# EAGLE schematic Yet-Another-LED-Cube (EAGLE 6.1)
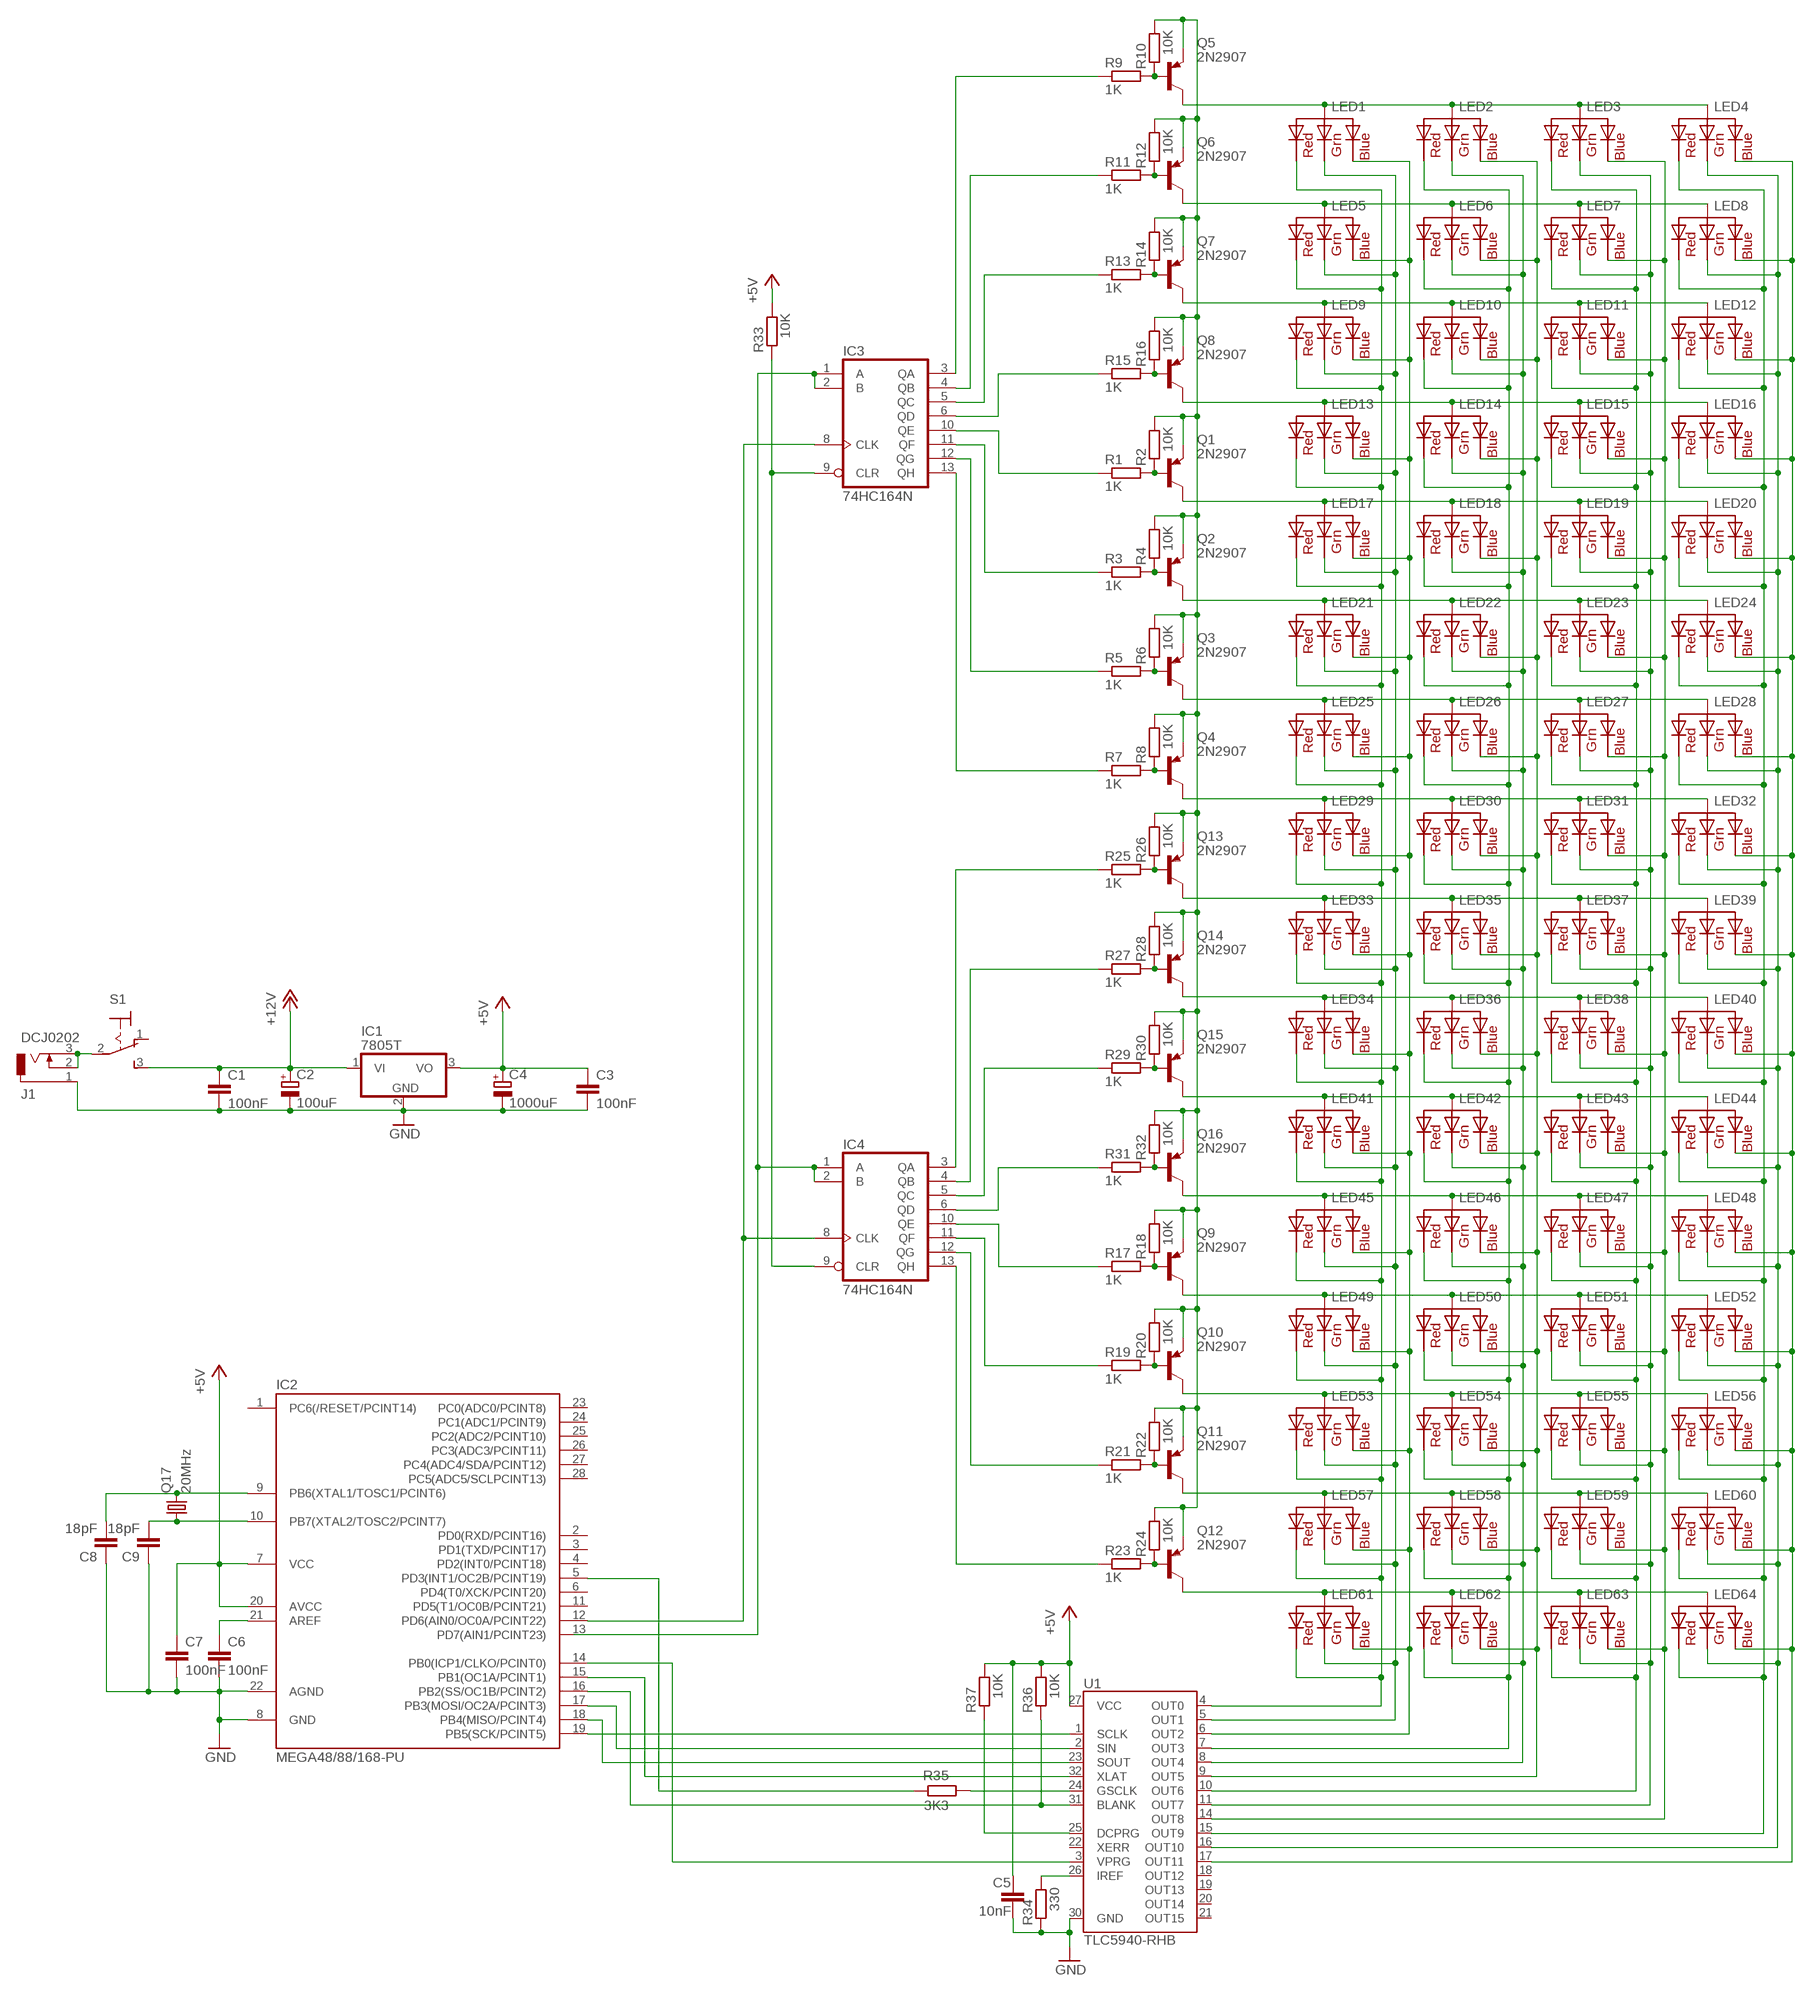
[diagram p0: schematic, sheet 1]

## Parts
C1  100nF  C-EU025-024X044  [C025-024X044]
C2  100uF  CPOL-EUE2.5-7  [E2,5-7]
C3  100nF  C-EU025-024X044  [C025-024X044]
C4  1000uF  CPOL-EUE3.5-10  [E3,5-10]
C5  10nF  C-EU025-024X044  [C025-024X044]
C6  100nF  C-EU025-024X044  [C025-024X044]
C7  100nF  C-EU025-024X044  [C025-024X044]
C8  18pF  C-EU025-024X044  [C025-024X044]
C9  18pF  C-EU025-024X044  [C025-024X044]
IC1  7805T  [TO220H]
IC2  MEGA48/88/168-PU  [DIL28-3]
IC3  74HC164N  [DIL14]
IC4  74HC164N  [DIL14]
J1  DCJ0202  [DCJ0202]
LED1  RGBLED_CAA  [LED5MMRGB2]
LED2  RGBLED_CAA  [LED5MMRGB2]
LED3  RGBLED_CAA  [LED5MMRGB2]
LED4  RGBLED_CAA  [LED5MMRGB2]
LED5  RGBLED_CAA  [LED5MMRGB2]
LED6  RGBLED_CAA  [LED5MMRGB2]
LED7  RGBLED_CAA  [LED5MMRGB2]
LED8  RGBLED_CAA  [LED5MMRGB2]
LED9  RGBLED_CAA  [LED5MMRGB2]
LED10  RGBLED_CAA  [LED5MMRGB2]
LED11  RGBLED_CAA  [LED5MMRGB2]
LED12  RGBLED_CAA  [LED5MMRGB2]
LED13  RGBLED_CAA  [LED5MMRGB2]
LED14  RGBLED_CAA  [LED5MMRGB2]
LED15  RGBLED_CAA  [LED5MMRGB2]
LED16  RGBLED_CAA  [LED5MMRGB2]
LED17  RGBLED_CAA  [LED5MMRGB2]
LED18  RGBLED_CAA  [LED5MMRGB2]
LED19  RGBLED_CAA  [LED5MMRGB2]
LED20  RGBLED_CAA  [LED5MMRGB2]
LED21  RGBLED_CAA  [LED5MMRGB2]
LED22  RGBLED_CAA  [LED5MMRGB2]
LED23  RGBLED_CAA  [LED5MMRGB2]
LED24  RGBLED_CAA  [LED5MMRGB2]
LED25  RGBLED_CAA  [LED5MMRGB2]
LED26  RGBLED_CAA  [LED5MMRGB2]
LED27  RGBLED_CAA  [LED5MMRGB2]
LED28  RGBLED_CAA  [LED5MMRGB2]
LED29  RGBLED_CAA  [LED5MMRGB2]
LED30  RGBLED_CAA  [LED5MMRGB2]
LED31  RGBLED_CAA  [LED5MMRGB2]
LED32  RGBLED_CAA  [LED5MMRGB2]
LED33  RGBLED_CAA  [LED5MMRGB2]
LED34  RGBLED_CAA  [LED5MMRGB2]
LED35  RGBLED_CAA  [LED5MMRGB2]
LED36  RGBLED_CAA  [LED5MMRGB2]
LED37  RGBLED_CAA  [LED5MMRGB2]
LED38  RGBLED_CAA  [LED5MMRGB2]
LED39  RGBLED_CAA  [LED5MMRGB2]
LED40  RGBLED_CAA  [LED5MMRGB2]
LED41  RGBLED_CAA  [LED5MMRGB2]
LED42  RGBLED_CAA  [LED5MMRGB2]
LED43  RGBLED_CAA  [LED5MMRGB2]
LED44  RGBLED_CAA  [LED5MMRGB2]
LED45  RGBLED_CAA  [LED5MMRGB2]
LED46  RGBLED_CAA  [LED5MMRGB2]
LED47  RGBLED_CAA  [LED5MMRGB2]
LED48  RGBLED_CAA  [LED5MMRGB2]
LED49  RGBLED_CAA  [LED5MMRGB2]
LED50  RGBLED_CAA  [LED5MMRGB2]
LED51  RGBLED_CAA  [LED5MMRGB2]
LED52  RGBLED_CAA  [LED5MMRGB2]
LED53  RGBLED_CAA  [LED5MMRGB2]
LED54  RGBLED_CAA  [LED5MMRGB2]
LED55  RGBLED_CAA  [LED5MMRGB2]
LED56  RGBLED_CAA  [LED5MMRGB2]
LED57  RGBLED_CAA  [LED5MMRGB2]
LED58  RGBLED_CAA  [LED5MMRGB2]
LED59  RGBLED_CAA  [LED5MMRGB2]
LED60  RGBLED_CAA  [LED5MMRGB2]
LED61  RGBLED_CAA  [LED5MMRGB2]
LED62  RGBLED_CAA  [LED5MMRGB2]
LED63  RGBLED_CAA  [LED5MMRGB2]
LED64  RGBLED_CAA  [LED5MMRGB2]
Q1  2N2907  [TO18]
Q2  2N2907  [TO18]
Q3  2N2907  [TO18]
Q4  2N2907  [TO18]
Q5  2N2907  [TO18]
Q6  2N2907  [TO18]
Q7  2N2907  [TO18]
Q8  2N2907  [TO18]
Q9  2N2907  [TO18]
Q10  2N2907  [TO18]
Q11  2N2907  [TO18]
Q12  2N2907  [TO18]
Q13  2N2907  [TO18]
Q14  2N2907  [TO18]
Q15  2N2907  [TO18]
Q16  2N2907  [TO18]
Q17  20MHz  CRYSTALHC49S  [HC49/S]
R1  1K  R-EU_0204/2V  [0204V]
R2  10K  R-EU_0204/2V  [0204V]
R3  1K  R-EU_0204/2V  [0204V]
R4  10K  R-EU_0204/2V  [0204V]
R5  1K  R-EU_0204/2V  [0204V]
R6  10K  R-EU_0204/2V  [0204V]
R7  1K  R-EU_0204/2V  [0204V]
R8  10K  R-EU_0204/2V  [0204V]
R9  1K  R-EU_0204/2V  [0204V]
R10  10K  R-EU_0204/2V  [0204V]
R11  1K  R-EU_0204/2V  [0204V]
R12  10K  R-EU_0204/2V  [0204V]
R13  1K  R-EU_0204/2V  [0204V]
R14  10K  R-EU_0204/2V  [0204V]
R15  1K  R-EU_0204/2V  [0204V]
R16  10K  R-EU_0204/2V  [0204V]
R17  1K  R-EU_0204/2V  [0204V]
R18  10K  R-EU_0204/2V  [0204V]
R19  1K  R-EU_0204/2V  [0204V]
R20  10K  R-EU_0204/2V  [0204V]
R21  1K  R-EU_0204/2V  [0204V]
R22  10K  R-EU_0204/2V  [0204V]
R23  1K  R-EU_0204/2V  [0204V]
R24  10K  R-EU_0204/2V  [0204V]
R25  1K  R-EU_0204/2V  [0204V]
R26  10K  R-EU_0204/2V  [0204V]
R27  1K  R-EU_0204/2V  [0204V]
R28  10K  R-EU_0204/2V  [0204V]
R29  1K  R-EU_0204/2V  [0204V]
R30  10K  R-EU_0204/2V  [0204V]
R31  1K  R-EU_0204/2V  [0204V]
R32  10K  R-EU_0204/2V  [0204V]
R33  10K  R-EU_0204/2V  [0204V]
R34  330  R-EU_0204/2V  [0204V]
R35  3K3  R-EU_0204/2V  [0204V]
R36  10K  R-EU_0204/2V  [0204V]
R37  10K  R-EU_0204/2V  [0204V]
S1  320-916  [320-916]
U1  TLC5940-RHB  [QFN-32]

## Nets
+5V: C3.1 C4.+ C5.1 C7.1 IC1.3(VO) IC2.7(VCC) IC2.20(AVCC) R33.2 R36.2 R37.2 U1.27(VCC)
+12V: C1.1 C2.+ IC1.1(VI) S1.3(S)
GND: C1.2 C2.- C3.2 C4.- C5.2 C6.2 C7.2 C8.1 C9.1 IC1.2(GND) IC2.8(GND) IC2.22(AGND) J1.1 R34.1 U1.30(GND)
N$1: J1.2 J1.3 S1.2(P)
N$2: Q1.2(B) R1.2 R2.1
N$3: Q2.2(B) R3.2 R4.1
N$4: Q3.2(B) R5.2 R6.1
N$5: Q4.2(B) R7.2 R8.1
N$6: Q5.2(B) R9.2 R10.1
N$7: Q6.2(B) R11.2 R12.1
N$8: Q7.2(B) R13.2 R14.1
N$9: Q8.2(B) R15.2 R16.1
N$10: LED1.P$1(RED) LED5.P$1(RED) LED9.P$1(RED) LED13.P$1(RED) LED17.P$1(RED) LED21.P$1(RED) LED25.P$1(RED) LED29.P$1(RED) LED33.P$1(RED) LED34.P$1(RED) LED41.P$1(RED) LED45.P$1(RED) LED49.P$1(RED) LED53.P$1(RED) LED57.P$1(RED) LED61.P$1(RED) U1.4(OUT0)
N$11: IC3.12(QG) R5.1
N$12: IC3.11(QF) R3.1
N$13: IC3.10(QE) R1.1
N$14: IC3.3(QA) R9.1
N$15: IC3.4(QB) R11.1
N$16: IC3.5(QC) R13.1
N$17: IC3.6(QD) R15.1
N$18: LED1.P$3(GREEN) LED5.P$3(GREEN) LED9.P$3(GREEN) LED13.P$3(GREEN) LED17.P$3(GREEN) LED21.P$3(GREEN) LED25.P$3(GREEN) LED29.P$3(GREEN) LED33.P$3(GREEN) LED34.P$3(GREEN) LED41.P$3(GREEN) LED45.P$3(GREEN) LED49.P$3(GREEN) LED53.P$3(GREEN) LED57.P$3(GREEN) LED61.P$3(GREEN) U1.5(OUT1)
N$19: Q9.2(B) R17.2 R18.1
N$20: Q10.2(B) R19.2 R20.1
N$21: Q11.2(B) R21.2 R22.1
N$22: Q12.2(B) R23.2 R24.1
N$23: Q13.2(B) R25.2 R26.1
N$24: Q14.2(B) R27.2 R28.1
N$25: Q15.2(B) R29.2 R30.1
N$26: Q16.2(B) R31.2 R32.1
N$27: IC4.12(QG) R21.1
N$28: IC4.11(QF) R19.1
N$29: IC4.10(QE) R17.1
N$30: IC4.3(QA) R25.1
N$31: IC4.4(QB) R27.1
N$32: IC4.5(QC) R29.1
N$33: IC4.6(QD) R31.1
N$34: IC2.19(PB5(SCK/PCINT5)) U1.1(SCLK)
N$35: LED1.P$2(VCC) LED2.P$2(VCC) LED3.P$2(VCC) LED4.P$2(VCC) Q5.3(C)
N$36: IC2.12(PD6(AIN0/OC0A/PCINT22)) IC3.8(CLK) IC4.8(CLK)
N$37: IC3.1(A) IC3.2(B) IC4.1(A) IC4.2(B)
N$38: LED1.P$4(BLUE) LED5.P$4(BLUE) LED9.P$4(BLUE) LED13.P$4(BLUE) LED17.P$4(BLUE) LED21.P$4(BLUE) LED25.P$4(BLUE) LED29.P$4(BLUE) LED33.P$4(BLUE) LED34.P$4(BLUE) LED41.P$4(BLUE) LED45.P$4(BLUE) LED49.P$4(BLUE) LED53.P$4(BLUE) LED57.P$4(BLUE) LED61.P$4(BLUE) U1.6(OUT2)
N$39: IC2.17(PB3(MOSI/OC2A/PCINT3)) U1.2(SIN)
N$40: IC3.9(CLR) IC4.9(CLR) R33.1
N$41: LED5.P$2(VCC) LED6.P$2(VCC) LED7.P$2(VCC) LED8.P$2(VCC) Q6.3(C)
N$42: LED2.P$1(RED) LED6.P$1(RED) LED10.P$1(RED) LED14.P$1(RED) LED18.P$1(RED) LED22.P$1(RED) LED26.P$1(RED) LED30.P$1(RED) LED35.P$1(RED) LED36.P$1(RED) LED42.P$1(RED) LED46.P$1(RED) LED50.P$1(RED) LED54.P$1(RED) LED58.P$1(RED) LED62.P$1(RED) U1.7(OUT3)
N$43: LED2.P$3(GREEN) LED6.P$3(GREEN) LED10.P$3(GREEN) LED14.P$3(GREEN) LED18.P$3(GREEN) LED22.P$3(GREEN) LED26.P$3(GREEN) LED30.P$3(GREEN) LED35.P$3(GREEN) LED36.P$3(GREEN) LED42.P$3(GREEN) LED46.P$3(GREEN) LED50.P$3(GREEN) LED54.P$3(GREEN) LED58.P$3(GREEN) LED62.P$3(GREEN) U1.8(OUT4)
N$44: LED2.P$4(BLUE) LED6.P$4(BLUE) LED10.P$4(BLUE) LED14.P$4(BLUE) LED18.P$4(BLUE) LED22.P$4(BLUE) LED26.P$4(BLUE) LED30.P$4(BLUE) LED35.P$4(BLUE) LED36.P$4(BLUE) LED42.P$4(BLUE) LED46.P$4(BLUE) LED50.P$4(BLUE) LED54.P$4(BLUE) LED58.P$4(BLUE) LED62.P$4(BLUE) U1.9(OUT5)
N$45: IC3.13(QH) R7.1
N$46: LED3.P$1(RED) LED7.P$1(RED) LED11.P$1(RED) LED15.P$1(RED) LED19.P$1(RED) LED23.P$1(RED) LED27.P$1(RED) LED31.P$1(RED) LED37.P$1(RED) LED38.P$1(RED) LED43.P$1(RED) LED47.P$1(RED) LED51.P$1(RED) LED55.P$1(RED) LED59.P$1(RED) LED63.P$1(RED) U1.10(OUT6)
N$47: LED3.P$3(GREEN) LED7.P$3(GREEN) LED11.P$3(GREEN) LED15.P$3(GREEN) LED19.P$3(GREEN) LED23.P$3(GREEN) LED27.P$3(GREEN) LED31.P$3(GREEN) LED37.P$3(GREEN) LED38.P$3(GREEN) LED43.P$3(GREEN) LED47.P$3(GREEN) LED51.P$3(GREEN) LED55.P$3(GREEN) LED59.P$3(GREEN) LED63.P$3(GREEN) U1.11(OUT7)
N$48: LED3.P$4(BLUE) LED7.P$4(BLUE) LED11.P$4(BLUE) LED15.P$4(BLUE) LED19.P$4(BLUE) LED23.P$4(BLUE) LED27.P$4(BLUE) LED31.P$4(BLUE) LED37.P$4(BLUE) LED38.P$4(BLUE) LED43.P$4(BLUE) LED47.P$4(BLUE) LED51.P$4(BLUE) LED55.P$4(BLUE) LED59.P$4(BLUE) LED63.P$4(BLUE) U1.14(OUT8)
N$49: IC2.18(PB4(MISO/PCINT4)) U1.23(SOUT)
N$50: LED4.P$1(RED) LED8.P$1(RED) LED12.P$1(RED) LED16.P$1(RED) LED20.P$1(RED) LED24.P$1(RED) LED28.P$1(RED) LED32.P$1(RED) LED39.P$1(RED) LED40.P$1(RED) LED44.P$1(RED) LED48.P$1(RED) LED52.P$1(RED) LED56.P$1(RED) LED60.P$1(RED) LED64.P$1(RED) U1.15(OUT9)
N$51: LED4.P$3(GREEN) LED8.P$3(GREEN) LED12.P$3(GREEN) LED16.P$3(GREEN) LED20.P$3(GREEN) LED24.P$3(GREEN) LED28.P$3(GREEN) LED32.P$3(GREEN) LED39.P$3(GREEN) LED40.P$3(GREEN) LED44.P$3(GREEN) LED48.P$3(GREEN) LED52.P$3(GREEN) LED56.P$3(GREEN) LED60.P$3(GREEN) LED64.P$3(GREEN) U1.16(OUT10)
N$52: LED4.P$4(BLUE) LED8.P$4(BLUE) LED12.P$4(BLUE) LED16.P$4(BLUE) LED20.P$4(BLUE) LED24.P$4(BLUE) LED28.P$4(BLUE) LED32.P$4(BLUE) LED39.P$4(BLUE) LED40.P$4(BLUE) LED44.P$4(BLUE) LED48.P$4(BLUE) LED52.P$4(BLUE) LED56.P$4(BLUE) LED60.P$4(BLUE) LED64.P$4(BLUE) U1.17(OUT11)
N$53: Q1.1(E) Q2.1(E) Q3.1(E) Q4.1(E) Q5.1(E) Q6.1(E) Q7.1(E) Q8.1(E) Q9.1(E) Q10.1(E) Q11.1(E) Q12.1(E) Q13.1(E) Q14.1(E) Q15.1(E) Q16.1(E) R2.2 R4.2 R6.2 R8.2 R10.2 R12.2 R14.2 R16.2 R18.2 R20.2 R22.2 R24.2 R26.2 R28.2 R30.2 R32.2
N$54: IC2.15(PB1(OC1A/PCINT1)) U1.32(XLAT)
N$55: IC2.5(PD3(INT1/OC2B/PCINT19)) R35.2
N$56: IC2.16(PB2(SS/OC1B/PCINT2)) R36.1 U1.31(BLANK)
N$57: IC2.14(PB0(ICP1/CLKO/PCINT0)) U1.3(VPRG)
N$58: R34.2 U1.26(IREF)
N$59: R35.1 U1.24(GSCLK)
N$60: R37.1 U1.25(DCPRG)
N$61: LED33.P$2(VCC) LED35.P$2(VCC) LED37.P$2(VCC) LED39.P$2(VCC) Q13.3(C)
N$62: LED34.P$2(VCC) LED36.P$2(VCC) LED38.P$2(VCC) LED40.P$2(VCC) Q14.3(C)
N$63: LED61.P$2(VCC) LED62.P$2(VCC) LED63.P$2(VCC) LED64.P$2(VCC) Q12.3(C)
N$64: LED57.P$2(VCC) LED58.P$2(VCC) LED59.P$2(VCC) LED60.P$2(VCC) Q11.3(C)
N$65: LED53.P$2(VCC) LED54.P$2(VCC) LED55.P$2(VCC) LED56.P$2(VCC) Q10.3(C)
N$66: LED49.P$2(VCC) LED50.P$2(VCC) LED51.P$2(VCC) LED52.P$2(VCC) Q9.3(C)
N$67: LED45.P$2(VCC) LED46.P$2(VCC) LED47.P$2(VCC) LED48.P$2(VCC) Q16.3(C)
N$68: LED41.P$2(VCC) LED42.P$2(VCC) LED43.P$2(VCC) LED44.P$2(VCC) Q15.3(C)
N$69: IC4.13(QH) R23.1
N$70: C6.1 IC2.21(AREF)
N$72: C8.2 IC2.9(PB6(XTAL1/TOSC1/PCINT6)) Q17.2
N$73: C9.2 IC2.10(PB7(XTAL2/TOSC2/PCINT7)) Q17.1
N$124: LED29.P$2(VCC) LED30.P$2(VCC) LED31.P$2(VCC) LED32.P$2(VCC) Q4.3(C)
N$125: LED25.P$2(VCC) LED26.P$2(VCC) LED27.P$2(VCC) LED28.P$2(VCC) Q3.3(C)
N$126: LED21.P$2(VCC) LED22.P$2(VCC) LED23.P$2(VCC) LED24.P$2(VCC) Q2.3(C)
N$127: LED17.P$2(VCC) LED18.P$2(VCC) LED19.P$2(VCC) LED20.P$2(VCC) Q1.3(C)
N$128: LED13.P$2(VCC) LED14.P$2(VCC) LED15.P$2(VCC) LED16.P$2(VCC) Q8.3(C)
N$129: LED9.P$2(VCC) LED10.P$2(VCC) LED11.P$2(VCC) LED12.P$2(VCC) Q7.3(C)
Unconnected: IC2.1(PC6(/RESET/PCINT14)) IC2.2(PD0(RXD/PCINT16)) IC2.3(PD1(TXD/PCINT17)) IC2.4(PD2(INT0/PCINT18)) IC2.6(PD4(T0/XCK/PCINT20)) IC2.11(PD5(T1/OC0B/PCINT21)) IC2.13(PD7(AIN1/PCINT23)) IC2.23(PC0(ADC0/PCINT8)) IC2.24(PC1(ADC1/PCINT9)) IC2.25(PC2(ADC2/PCINT10)) IC2.26(PC3(ADC3/PCINT11)) IC2.27(PC4(ADC4/SDA/PCINT12)) IC2.28(PC5(ADC5/SCLPCINT13)) S1.1(O) U1.18(OUT12) U1.19(OUT13) U1.20(OUT14) U1.21(OUT15) U1.22(XERR)

## Power pins joined to a net without a drawn wire
GND: IC3.7(GND) IC4.7(GND)
VCC: IC3.14(VCC) IC4.14(VCC)

## Library data of the parts
C1 C3 C5-C9 = rcl:C-EU: CAPACITOR, European symbol
C2 C4 = rcl:CPOL-EU: POLARIZED CAPACITOR, European symbol
IC1 = linear:78*: Positive VOLTAGE REGULATOR Source: http://cache.national.com/ds/LM/LM78L05.pdf http://www.fairchildsemi.com/ds/LM/LM7805.pdf
IC2 = avr-6:MEGA48/88/168-PU
IC3 IC4 = 74xx-eu:74*164: 8-bit parallel out SHIFT REGISTER
J1 = con-jack:DCJ0202: DC POWER JACK Source: DCJ0202.pdf; OC_FARNELL: unknown; OC_NEWARK: unknown
LED1-LED64 = adafruit:RGBLED_CAA
Q1-Q16 = transistor-pnp:2N2907*: PNP Transistor
Q17 = crystal:CRYSTAL: CRYSTAL; OC_FARNELL: 1667008; OC_NEWARK: unknown
R1-R37 = resistor:R-EU_: RESISTOR, European symbol
S1 = switch:320-916: TOGGLE SWITCH distributor RS Components
U1 = SparkFun:TLC5940: TI TLC5940 16-channel LED Driver with Dot Correction and Grayscale PWM Control The TLC5940 is a 16-channel, constant-current sink LED driver. Each channel has an individually adjustable 4096-step grayscale PWM brightness control and a 64-step, constant-current sink (dot correction). The dot correction adjusts the brightness variations between LED channels and other LED drivers. The dot correction data is stored in an integrated EEPROM. Both grayscale control and dot correction are accessible via a serial interface. A single external resistor sets the maximum current value of all 16 channels. Packages: 28-pin HTSSOP 32-pin 5x5mm QFN 28-pin DIP